# EAGLE design Benes_bel (EAGLE 7.7.0)
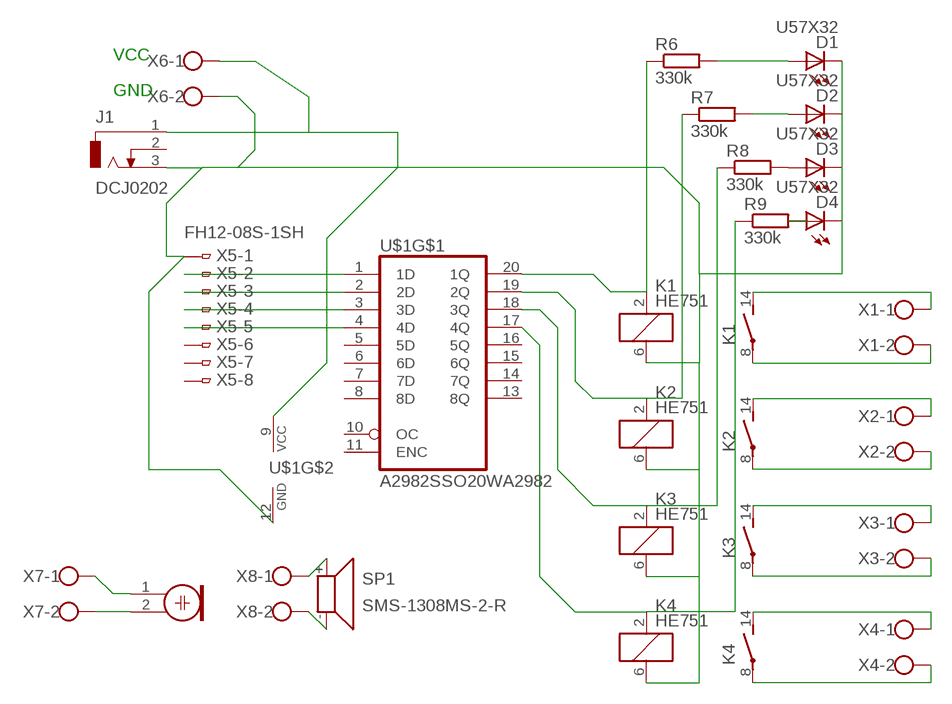
[diagram p0: schematic, sheet 1]

## Parts
D1  U57X32  [U57X32]
D2  U57X32  [U57X32]
D3  U57X32  [U57X32]
D4  U57X32  [U57X32]
J1  DCJ0202  [DCJ0202]
K1  HE751  [HE751]
K2  HE751  [HE751]
K3  HE751  [HE751]
K4  HE751  [HE751]
M1  ELECTRET_MICROPHON-WM-61B  [WM-61B]
R6  330k  R-EU_0207/12  [0207/12]
R7  330k  R-EU_0207/12  [0207/12]
R8  330k  R-EU_0207/12  [0207/12]
R9  330k  R-EU_0207/12  [0207/12]
SP1  SMS-1308MS-2-R  [SMS-1308MS-2-R]
U$1  A2982SSO20WA2982  [SO20W]
X1  W237-102  [W237-102]
X2  W237-102  [W237-102]
X3  W237-102  [W237-102]
X4  W237-102  [W237-102]
X5  FH12-08S-1SH  [FH12-08S-1SH]
X6  W237-102  [W237-102]
X7  W237-102  [W237-102]
X8  W237-102  [W237-102]

## Nets
N$1: U$1.1(1D) X5.2
N$2: U$1.2(2D) X5.3
N$3: U$1.3(3D) X5.4
N$4: U$1.4(4D) X5.5
N$5: K2.2 R7.1 U$1.19(2Q)
N$6: SP1.+ X8.1
N$7: SP1.- X8.2
N$8: M1.1 X7.1
N$9: M1.2 X7.2
N$11: K1.14(2:S) X1.1
N$12: K1.8(2:P) X1.2
N$13: K2.14(2:S) X2.1
N$14: K2.8(2:P) X2.2
N$15: K3.14(2:S) X3.1
N$16: K3.8(2:P) X3.2
N$17: K4.14(2:S) X4.1
N$18: K4.8(2:P) X4.2
N$19: K3.2 R8.1 U$1.18(3Q)
N$20: K4.2 R9.1 U$1.17(4Q)
N$21: D1.K(C) D2.K(C) D3.K(C) D4.K(C) J1.3 K1.6 K2.6 K3.6 K4.6 U$1.12(GND) X5.1 X6.2
N$22: J1.1 U$1.9(VCC) X6.1
N$23: K1.2 R6.1 U$1.20(1Q)
N$24: D4.A R9.2
N$25: D1.A R6.2
N$26: D2.A R7.2
N$27: D3.A R8.2
Unconnected: J1.2 U$1.5(5D) U$1.6(6D) U$1.7(7D) U$1.8(8D) U$1.10(OC) U$1.11(ENC) U$1.13(8Q) U$1.14(7Q) U$1.15(6Q) U$1.16(5Q) X5.6 X5.7 X5.8

## Notes on the sheet
- VCC
- GND

## Library data of the parts
D1-D4 = led:U57X32: LED rectangle, 5.7 x 3.2 mm
J1 = con-jack:DCJ0202: DC POWER JACK Source: DCJ0202.pdf; OC_FARNELL: unknown; OC_NEWARK: unknown
K1-K4 = relay:HE751: RELAY reed, 1 x norm. open, Hamlin; OC_FARNELL: unknown; OC_NEWARK: unknown
M1 = microphon:ELECTRET_MICROPHON-: Electret Condenser Microphone
R6-R9 = resistor:R-EU_: RESISTOR, European symbol
SP1 = speaker:SMS-1308MS-2-R: Speaker 13 x 13mm, 8 Ohm, 0.7W Source: pui audio inc. SMS-1308MS-2-R.pdf
U$1 = gxb:A2982
X1-X4 X6-X8 = con-wago-500:W237-102: WAGO SCREW CLAMP; MPN: 237-102; OC_FARNELL: unknown; OC_NEWARK: 70K9898
X5 = con-hirose:FH12-08S-1S: 1mm Pitch Connectors For FPC/FFC Source: Data sheet <http://www.hirose.co.jp/cataloge_hp/e58605370.pdf>; OC_FARNELL: unknown; OC_NEWARK: unknown

## Net classes
0 default: clearance 0.205 mm

## Board
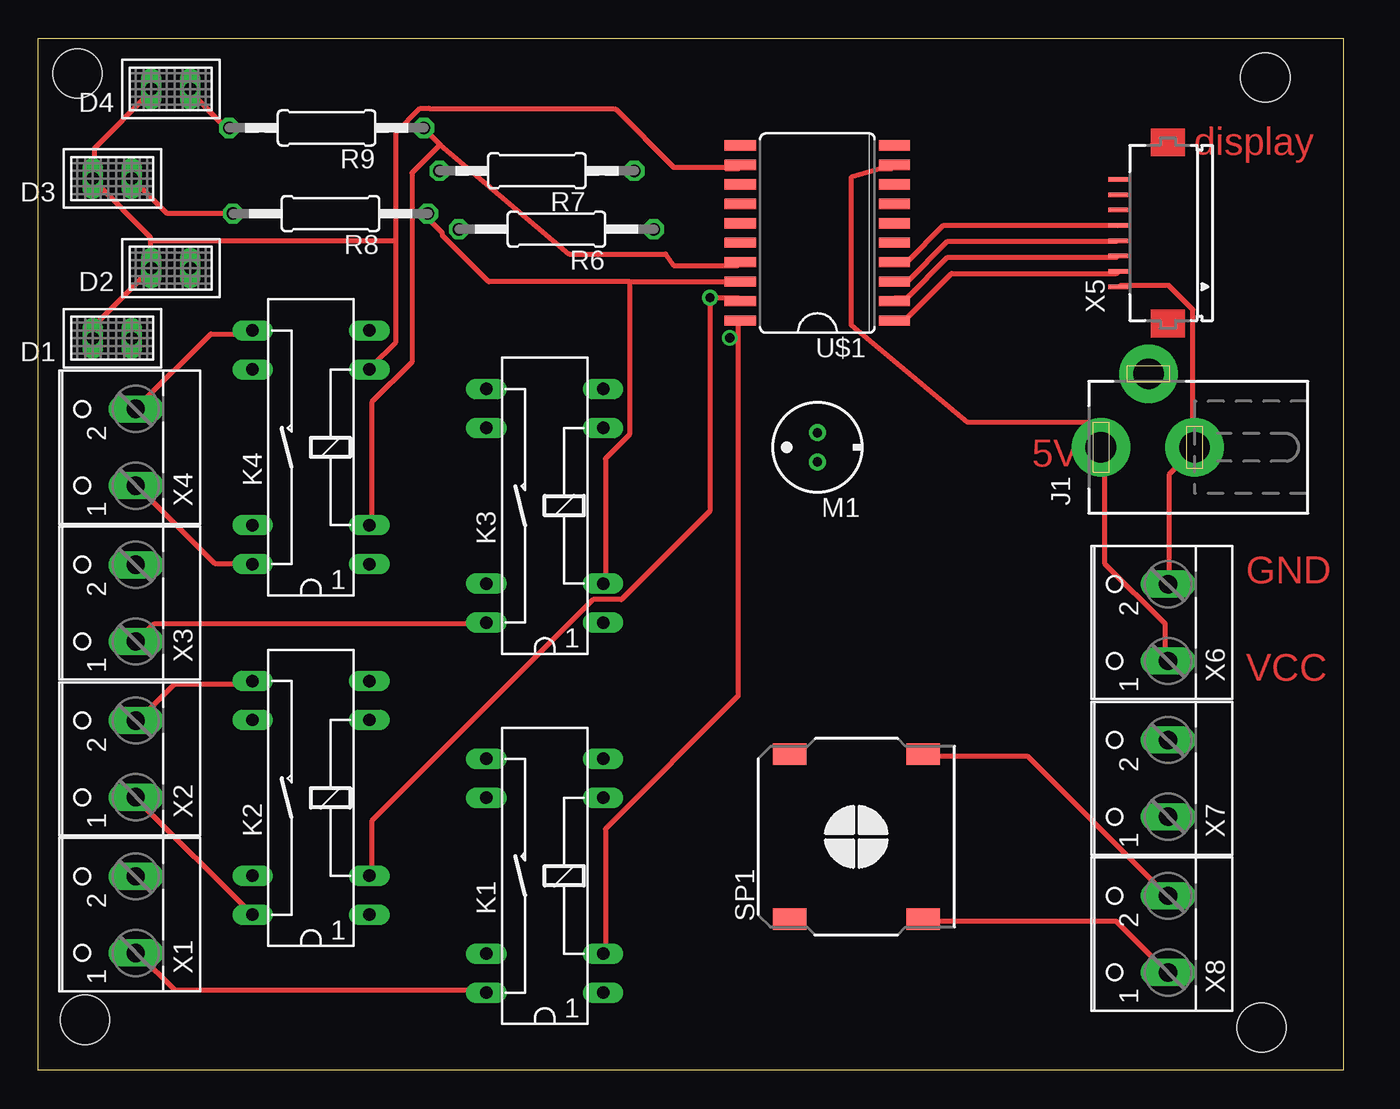
[diagram p1: board, top side]
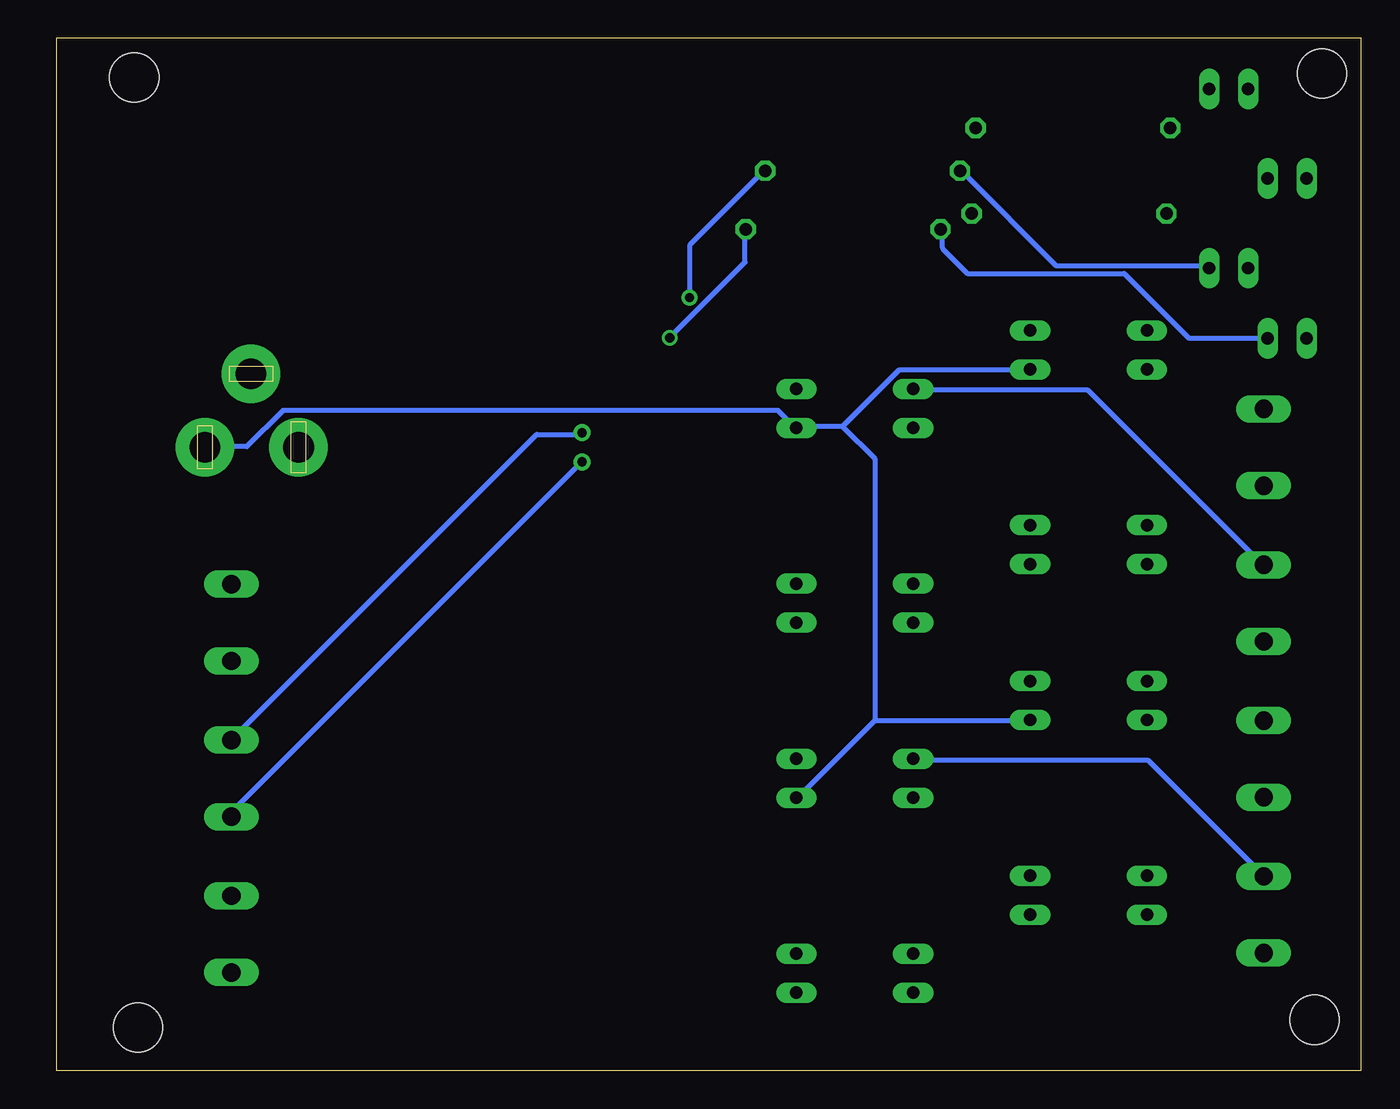
[diagram p2: board, bottom side, seen from below]

Size 85.09 x 67.31 mm. Coordinates in mm from the lower left corner, seen from the top.
Outline: 0,0 0,67.31 85.09,67.31 85.09,0 0,0
Copper layers (1*16): Top 0.035mm / dielectric 1.5mm / Bottom 0.035mm
Design rules "Benes_bel *": minimum track width 0.32mm, minimum drill 24mil, track to track 0.205mm, track to pad 0.205mm, pad to pad 0.205mm, via to via 0.205mm, smd to smd 8mil, copper to edge 40mil, drill to drill 8mil, minimum pad ring 10mil, minimum via ring 8mil, stop-mask expansion 4mil, vias tented up to drill 0mil, thermal gap 10mil
Holes 3.2 mm at 2.54,65.02 3.05,3.3 80.01,64.77 79.76,2.79

### Footprints (pad centres in the part's own frame; a part is rotated, then mirrored left to right if it is on the bottom)
U57X32 = drill 0.813 long: A -1.27,0; K 1.27,0
DCJ0202 = drill 2 pad 3.81: 1 0,3.1; 2 4.8,0; 3 0,-3
HE751 = drill 0.813 long: 1 -7.62,-3.81; 2 -5.08,-3.81; 6 5.08,-3.81; 7 7.62,-3.81; 8 7.62,3.81; 9 5.08,3.81; 13 -5.08,3.81; 14 -7.62,3.81
WM-61B = drill 0.6 pad 1: 1 0,0.95; 2 0,-0.95
0207/12 = drill 0.813 octagon: 1 -6.35,0; 2 6.35,0
SMS-1308MS-2-R = smd 1.4 x 2.2: + -5.375,-4.35; - 5.375,-4.35; M1 -5.375,4.35; M2 5.375,4.35
SO20W = smd 0.66 x 2.032: 1 -5.715,-5.029; 2 -4.445,-5.029; 3 -3.175,-5.029; 4 -1.905,-5.029; 5 -0.635,-5.029; 6 0.635,-5.029; 7 1.905,-5.029; 8 3.175,-5.029; 9 4.445,-5.029; 10 5.715,-5.029; 11 5.715,5.029; 12 4.445,5.029; 13 3.175,5.029; 14 1.905,5.029; 15 0.635,5.029; 16 -0.635,5.029; 17 -1.905,5.029; 18 -3.175,5.029; 19 -4.445,5.029; 20 -5.715,5.029
W237-102 = drill 1.194 long: 1 -2.5,-1.27; 2 2.5,-1.27
FH12-08S-1SH = smd 0.3 x 1.3: 1 -3.5,3.25; 2 -2.5,3.25; 3 -1.5,3.25; 4 -0.5,3.25; 5 0.5,3.25; 6 1.5,3.25; 7 2.5,3.25; 8 3.5,3.25

### Placement (x,y rotation side)
D1  4.83,47.75 180 top
D2  8.64,52.32 180 top
D3  4.83,58.17 180 top
D4  8.64,64.01 180 top
J1  72.39,40.64 90 top
K1  33.02,12.7 90 top
K2  17.78,17.78 90 top
K3  33.02,36.83 90 top
K4  17.78,40.64 90 top
M1  50.8,40.64 180 top
R6  33.78,54.86 180 top
R7  32.51,58.67 180 top
R8  19.05,55.88 180 top
R9  18.8,61.47 180 top
SP1  53.34,15.24 90 top
U$1  50.8,54.61 90 top
X1  5.08,10.16 90 top
X2  5.08,20.32 90 top
X3  5.08,30.48 90 top
X4  5.08,40.64 90 top
X5  73.66,54.61 90 top
X6  72.39,29.21 90 top
X7  72.39,19.05 90 top
X8  72.39,8.89 90 top

### Tracks (layer width: path | path; a pad name or v marks a point on that pad's centre or on a via)
N$1
  Top 0.32: X5.2 70.31,51.98 59.55,51.98 56.66,49.09 55.87,49.09 U$1.1
N$2
  Top 0.32: X5.3 70.31,53.02 59.28,53.02 56.66,50.4 55.87,50.4 U$1.2
N$3
  Top 0.32: X5.4 70.31,54.08 59.28,54.08 56.66,51.45 55.87,51.45 U$1.3
N$4
  Top 0.32: X5.5 70.31,55.12 59.02,55.12 56.66,52.76 55.87,52.76 U$1.4
N$5  (via drill 0.61)
  Top 0.32: U$1.19 45.63,50.4 v43.8,50.4 43.8,36.49 38.02,30.71 36.18,30.71 21.75,16.27 21.75,12.86 K2.2
  Bottom 0.32: v43.8,50.4 43.8,53.81 39.07,58.54 R7.1
N$6
  Top 0.32: SP1.+ 57.71,9.71 70.31,9.71 73.46,6.56 X8.1
N$7
  Top 0.32: SP1.- 57.71,20.48 64.53,20.48 73.46,11.55 X8.2
N$8
  Bottom 0.32: M1.1 50.88,39.64 73.72,16.8 X7.1
N$9
  Bottom 0.32: M1.2 50.88,41.48 53.77,41.48 73.46,21.79 X7.2
N$11
  Top 0.32: K1.14 29.09,5.25 8.88,5.25 6.52,7.61 X1.1
N$12
  Bottom 0.32: K1.8 29.09,20.21 13.87,20.21 6.52,12.86 X1.2
N$13
  Top 0.32: K2.14 13.87,10.24 6.52,17.59 X2.1
N$14
  Top 0.32: K2.8 13.87,25.2 8.88,25.2 6.52,22.84 X2.2
N$15
  Top 0.32: K3.14 29.09,29.14 7.57,29.14 6.52,28.09 X3.1
N$16
  Bottom 0.32: K3.8 29.09,44.36 17.81,44.36 6.52,33.08 X3.2
N$17
  Top 0.32: K4.14 13.87,33.08 11.51,33.08 6.52,38.06 X4.1
N$18
  Top 0.32: K4.8 13.87,48.04 11.24,48.04 6.52,43.31 X4.2
N$19
  Top 0.32: U$1.18 45.63,51.45 38.55,51.45 38.55,51.44 | 25.42,55.65 R8.1 25.4,55.56 26.35,54.61 26.35,54.45 29.37,51.44 38.55,51.44 | 38.55,51.44 38.55,41.48 36.97,39.9 36.97,31.76 K3.2
N$20
  Top 0.32: 26.21,60.38 25.16,61.42 R9.1 | 26.21,60.38 34.61,53.24 40.91,53.24 41.43,52.5 45.63,52.5 U$1.17 | 26.21,60.38 24.37,58.54 24.37,46.2 21.75,43.58 21.75,35.7 K4.2
N$21
  Top 0.32: X5.1 70.57,51.19 73.72,51.19 75.3,49.61 75.3,40.69 J1.3 75.3,40.42 73.72,38.85 73.72,31.76 X6.2 | D1.K 3.63,47.77 3.63,48.56 7.31,52.24 D2.K 7.31,52.5 7.31,54.08 | D4.K 7.31,63.79 3.63,60.11 3.63,58.27 D3.K 3.63,58.01 7.31,54.34 7.31,54.08 | 44.85,58.8 45.63,58.8 U$1.12 44.77,58.9 41.43,58.9 37.62,62.71 25.56,62.71 25.42,62.74 24.89,62.74 23.32,61.16 23.32,54.08 | 23.32,54.08 23.32,47.51 21.75,45.94 K4.6 | 23.32,54.08 7.31,54.08
  Bottom 0.32: 31.72,22.84 21.75,22.84 K2.6 | 31.72,22.84 36.71,17.85 K1.6 | 33.82,42 36.71,42 K3.6 36.97,42 38.02,43.05 70.31,43.05 72.67,40.69 75.3,40.69 J1.3 | 33.82,42 30.14,45.67 21.75,45.67 K4.6 | 31.72,22.84 31.72,39.9 33.82,42
N$22
  Top 0.32: U$1.9 55.61,58.8 54.82,58.8 53.03,58.27 53.03,48.56 60.6,42.26 68.47,42.26 69.26,41.48 69.26,40.69 J1.1 69.52,40.42 69.52,33.08 73.46,29.14 73.46,26.77 X6.1
N$23  (via drill 0.61)
  Top 0.32: 45.63,47.78 45.63,48.83 U$1.20 | 45.63,47.78 45.63,24.41 36.97,15.75 36.97,7.88 K1.2 | 45.63,47.78 v45.09,47.78
  Bottom 0.32: v45.09,47.78 40.16,52.7 40.16,54.77 R6.1
N$24
  Top 0.32: D4.A 9.93,63.79 12.29,61.42 R9.2
N$25
  Bottom 0.32: D1.A 6.26,47.77 11.24,47.77 15.45,51.98 25.68,51.98 27.26,53.55 27.3,53.66 27.3,54.77 R6.2
N$26
  Bottom 0.32: D2.A 9.93,52.5 19.91,52.5 25.95,58.54 R7.2
N$27
  Top 0.32: R8.2 12.56,55.91 8.36,55.91 6.26,58.01 D3.A

### Text on the board
Top: -> display | 5V | GND | VCC